# Altium project AUX_v7_4.PrjPcb
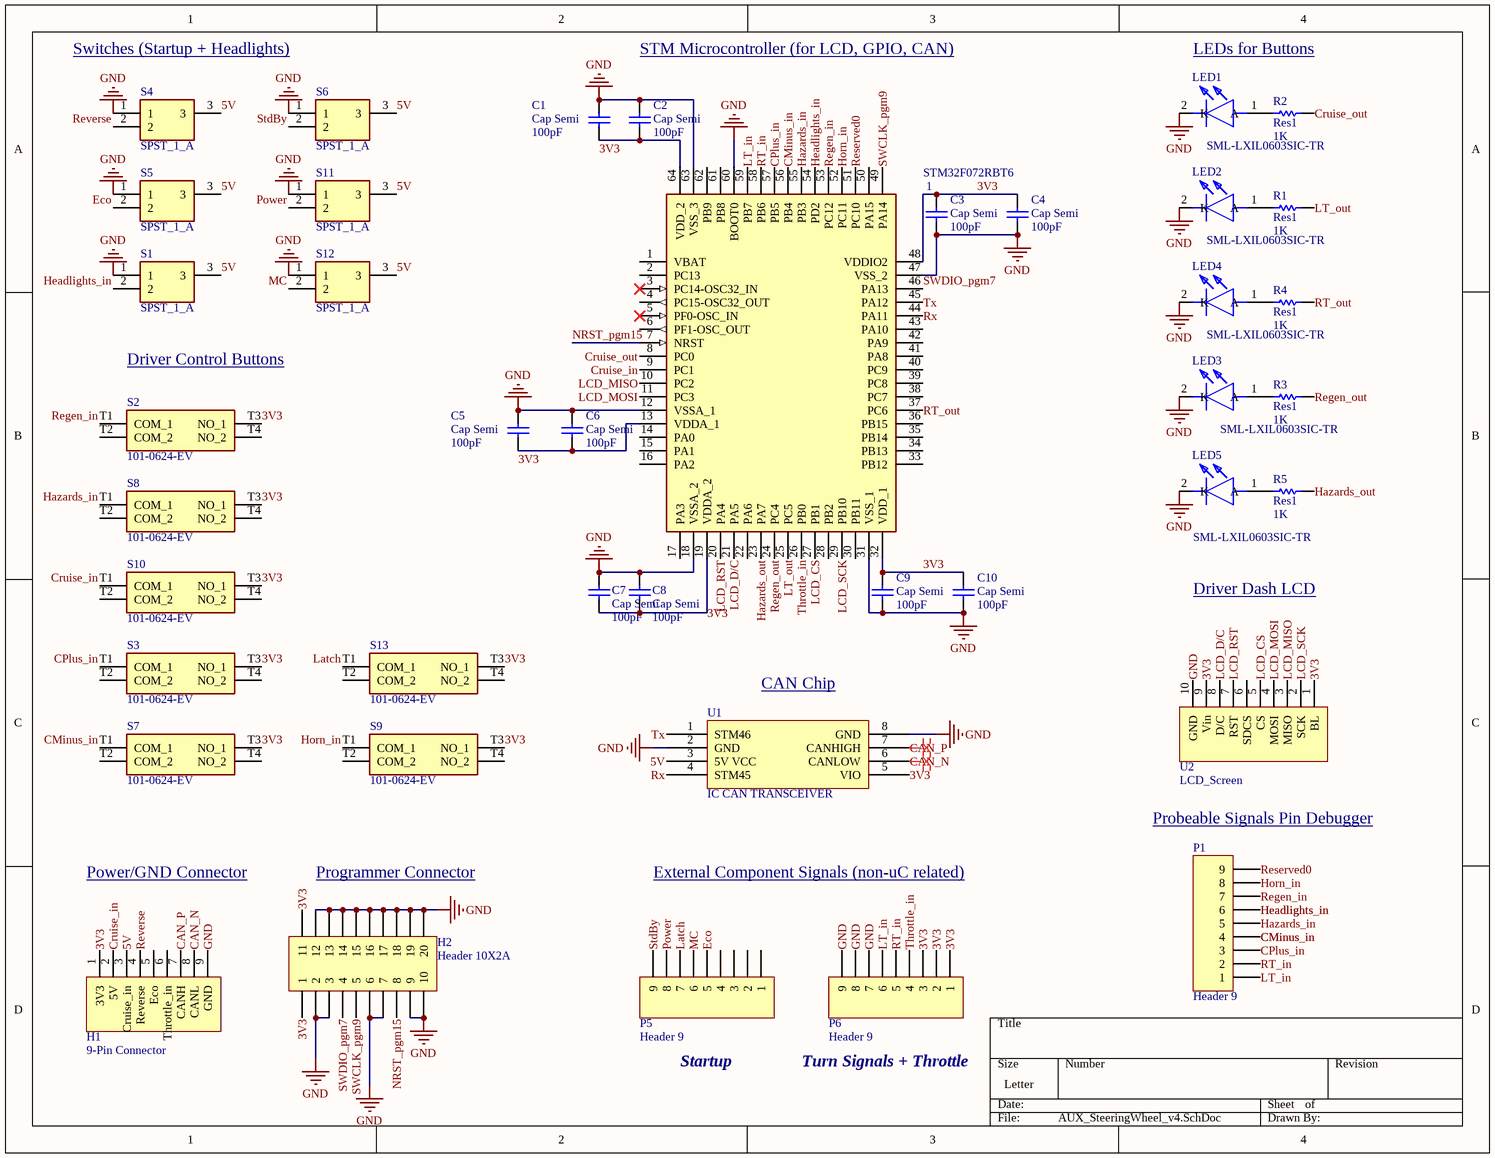
[diagram p0: AUX_SteeringWheel_v4.SchDoc]
1 sheet, 41 parts. Net scope: global (net labels, ports and power ports of the same name join across sheets).
Board file: AUX_SteeringWheel_v4.PcbDoc

## Sheet AUX_SteeringWheel_v4.SchDoc
size Letter

### Parts
1  STM32F072RBT6  [QFP50P1200X1200X160-64N]
C1  Cap Semi  value 100pF  [C1206]
C2  Cap Semi  value 100pF  [C1206]
C3  Cap Semi  value 100pF  [C1206]
C4  Cap Semi  value 100pF  [C1206]
C5  Cap Semi  value 100pF  [C1206]
C6  Cap Semi  value 100pF  [C1206]
C7  Cap Semi  value 100pF  [C1206]
C8  Cap Semi  value 100pF  [C1206]
C9  Cap Semi  value 100pF  [C1206]
C10  Cap Semi  value 100pF  [C1206]
H1  9-Pin Connector  [Rt_Angle_9-Pin]
H2  Header 10X2A  [HDR2X10_CEN]
LED1  SML-LXIL0603SIC-TR  [LED thru hole]
LED2  SML-LXIL0603SIC-TR  [LED thru hole]
LED3  SML-LXIL0603SIC-TR  [LED thru hole]
LED4  SML-LXIL0603SIC-TR  [LED thru hole]
LED5  SML-LXIL0603SIC-TR  [LED thru hole]
P1  Header 9  [HDR1X9]
P5  Header 9  [Rt_Angle_9-Pin]
P6  Header 9  [Rt_Angle_9-Pin]
R1  Res1  value 1K  [AXIAL-0.3]
R2  Res1  value 1K  [AXIAL-0.3]
R3  Res1  value 1K  [AXIAL-0.3]
R4  Res1  value 1K  [AXIAL-0.3]
R5  Res1  value 1K  [AXIAL-0.3]
S1  SPST_1_A  [2M1SP3T1B1M2QE]
S2  101-0624-EV  [1010624EV]
S3  101-0624-EV  [1010624EV]
S4  SPST_1_A  [2M1SP3T1B1M2QE]
S5  SPST_1_A  [2M1SP3T1B1M2QE]
S6  SPST_1_A  [2M1SP3T1B1M2QE]
S7  101-0624-EV  [1010624EV]
S8  101-0624-EV  [1010624EV]
S9  101-0624-EV  [1010624EV]
S10  101-0624-EV  [1010624EV]
S11  SPST_1_A  [2M1SP3T1B1M2QE]
S12  SPST_1_A  [2M1SP3T1B1M2QE]
S13  101-0624-EV  [1010624EV]
U1  IC CAN TRANSCEIVER  [CAN TRANSCEIVER]
U2  LCD_Screen  [LCD_Screen]

### Nets
GND: 1.12(VSSA_1) 1.18(VSSA_2) 1.31(VSS_1) 1.47(VSS_2) 1.60(BOOT0) 1.63(VSS_3) C1.2 C2.2 C3.1 C4.1 C5.2 C6.2 C7.2 C8.2 C9.1 C10.1 H1.9(GND) H2.2 H2.3 H2.6 H2.7 H2.9 H2.10 H2.12 H2.13 H2.14 H2.15 H2.16 H2.17 H2.18 H2.19 H2.20 LED1.2(K) LED2.2(K) LED3.2(K) LED4.2(K) LED5.2(K) P6.7 P6.8 P6.9 S1.1 S4.1 S5.1 S6.1 S11.1 S12.1 U1.2(GND) U1.8(GND) U2.10(GND)
3V3: 1.13(VDDA_1) 1.19(VDDA_2) 1.32(VDD_1) 1.48(VDDIO2) 1.64(VDD_2) C1.1 C2.1 C3.2 C4.2 C5.1 C6.1 C7.1 C8.1 C9.2 C10.2 H1.1(3V3) H2.1 H2.11 P6.1 P6.2 P6.3 S2.T3(NO_1) S3.T3(NO_1) S7.T3(NO_1) S8.T3(NO_1) S9.T3(NO_1) S10.T3(NO_1) S13.T3(NO_1) U1.5(VIO) U2.1(BL) U2.9(Vin)
5V: H1.3(Cruise_in) S1.3 S4.3 S5.3 S6.3 S11.3 S12.3 U1.3(5V_VCC)
CAN_N: H1.8(CANL) U1.6(CANLOW)
CAN_P: H1.7(CANH) U1.7(CANHIGH)
CMinus_in: 1.56(PB4) P1.4 S7.T1(COM_1)
CPlus_in: 1.57(PB5) P1.3 S3.T1(COM_1)
Cruise_in: 1.9(PC1) H1.2(5V) S10.T1(COM_1)
Cruise_out: 1.8(PC0) R2.1
Eco: P5.5 S5.2
Hazards_in: 1.55(PB3) P1.5 S8.T1(COM_1)
Hazards_out: 1.23(PA7) R5.1
Headlights_in: 1.54(PD2) P1.6 S1.2
Horn_in: 1.52(PC11) P1.8 S9.T1(COM_1)
Latch: P5.7 S13.T1(COM_1)
LCD_CS: 1.27(PB1) U2.5(CS)
LCD_D/C: 1.21(PA5) U2.8(D/C)
LCD_MISO: 1.10(PC2) U2.3(MISO)
LCD_MOSI: 1.11(PC3) U2.4(MOSI)
LCD_RST: 1.20(PA4) U2.7(RST)
LCD_SCK: 1.29(PB10) U2.2(SCK)
LT_in: 1.59(PB7) P1.1 P6.6
LT_out: 1.25(PC5) R1.1
MC: P5.6 S12.2
NRST_pgm15: 1.7(NRST) H2.8
Power: P5.8 S11.2
Regen_in: 1.53(PC12) P1.7 S2.T1(COM_1)
Regen_out: 1.24(PC4) R3.1
Reserved0: 1.51(PC10) P1.9
Reverse: H1.4(Reverse) S4.2
RT_in: 1.58(PB6) P1.2 P6.5
RT_out: 1.37(PC6) R4.1
Rx: 1.44(PA11) U1.4(STM45)
StdBy: P5.9 S6.2
SWCLK_pgm9: 1.49(PA14) H2.5
SWDIO_pgm7: 1.46(PA13) H2.4
Throttle_in: 1.26(PB0) P6.4
Tx: 1.45(PA12) U1.1(STM46)
NetLED1_1: LED1.1(A) R2.2
NetLED2_1: LED2.1(A) R1.2
NetLED3_1: LED3.1(A) R3.2
NetLED4_1: LED4.1(A) R4.2
NetLED5_1: LED5.1(A) R5.2

Not connected (* = marked no-connect by the designer): 1 1(VBAT) 2(PC13) 3(PC14-OSC32_IN)* 4(PC15-OSC32_OUT) 5(PF0-OSC_IN)* 6(PF1-OSC_OUT) 14(PA0) 15(PA1) 16(PA2) 17(PA3) 22(PA6) 28(PB2) 30(PB11) 33(PB12) 34(PB13) 35(PB14) 36(PB15) 38(PC7) 39(PC8) 40(PC9) 41(PA8) 42(PA9) 43(PA10) 50(PA15) 61(PB8) 62(PB9); H1 5(Eco) 6(Throttle_in); P5 1 2 3 4; S2 T2(COM_2) T4(NO_2); S3 T2(COM_2) T4(NO_2); S7 T2(COM_2) T4(NO_2); S8 T2(COM_2) T4(NO_2); S9 T2(COM_2) T4(NO_2); S10 T2(COM_2) T4(NO_2); S13 T2(COM_2) T4(NO_2); U2 6(SDCS)

### Layout directives
differential pair: CAN_N, CAN_P

### Notes on the sheet
- Switches (Startup + Headlights)
- STM Microcontroller (for LCD, GPIO, CAN)
- LEDs for Buttons
- Driver Control Buttons
- Driver Dash LCD
- (near U1) CAN Chip
- (near P1) Probeable Signals Pin Debugger
- Power/GND Connector
- Programmer Connector
- External Component Signals (non-uC related)
- Startup
- Turn Signals + Throttle

### Library data of the parts
1 = STM32F072RBT6: Integrated Circuit; Manufacturer_Name: STMicroelectronics; Datasheet Link: https://componentsearchengine.com/Datasheets/1/STM32F072RBT6.pdf; Height: 1.6mm; Mouser Part Number: 511-STM32F072RBT6; Mouser Price/Stock: https://www.mouser.com/Search/Refine.aspx?Keyword=511-STM32F072RBT6; Manufacturer_Part_Number: STM32F072RBT6
C1-C10 = Cap Semi: Capacitor (Semiconductor SIM Model); Published: 8-Jun-2000; LatestRevisionDate: 29-May-2009; LatestRevisionNote: IPC-7351 Footprint Added.; PackageReference: C1206; Publisher: Altium Limited; PackageDescription: Chip Capacitor
H2 = Header 10X2A: Header, 10-Pin, Dual row; LatestRevisionDate: 17-Jul-2002; LatestRevisionNote: Re-released for DXP Platform.; Publisher: Altium Limited
LED1 LED2 LED4 = SML-LXIL0603SIC-TR: Cruise; Manufacturer_Name: Lumex; Datasheet Link: https://componentsearchengine.com/Datasheets/1/SML-LXIL0603SIC-TR.pdf; Height: 1.15mm; Mouser2 Part Number: 696-SMLLXIL0603SICTR; Mouser2 Price/Stock: https://www.mouser.com/Search/Refine.aspx?Keyword=696-SMLLXIL0603SICTR; Manufacturer_Part_Number: SML-LXIL0603SIC-TR; ComponentLink1Description: Red; ComponentLink1URL: https://www.mouser.com/ProductDetail/Lumex/SML-LXIL0603SIC-TR?qs=sGAEpiMZZMseGfSY3csMkdgyOOAg6kv2wBhnt1KKZ0Ir1Jo46E1V3Q%3D%3D; ComponentLink2Description: Green; ComponentLink2URL: https://www.mouser.com/ProductDetail/Lumex/SML-LXIL0603UPGCTR?qs=sGAEpiMZZMseGfSY3csMkdgyOOAg6kv2sRjHcnaWQfp%2F9Np9qK5zmw%3D%3D; ComponentLink3Description: Blue; ComponentLink3URL: https://www.mouser.com/ProductDetail/Lumex/SML-LXIL0603USBCTR?qs=sGAEpiMZZMseGfSY3csMkdgyOOAg6kv2YTCj%2FpdrnHQXx1e9lymIRQ%3D%3D
LED3 = SML-LXIL0603SIC-TR: Headlights; Manufacturer_Name: Lumex; Datasheet Link: https://componentsearchengine.com/Datasheets/1/SML-LXIL0603SIC-TR.pdf; Height: 1.15mm; Mouser2 Part Number: 696-SMLLXIL0603SICTR; Mouser2 Price/Stock: https://www.mouser.com/Search/Refine.aspx?Keyword=696-SMLLXIL0603SICTR; Manufacturer_Part_Number: SML-LXIL0603SIC-TR; ComponentLink1Description: Red; ComponentLink1URL: https://www.mouser.com/ProductDetail/Lumex/SML-LXIL0603SIC-TR?qs=sGAEpiMZZMseGfSY3csMkdgyOOAg6kv2wBhnt1KKZ0Ir1Jo46E1V3Q%3D%3D; ComponentLink2Description: Green; ComponentLink2URL: https://www.mouser.com/ProductDetail/Lumex/SML-LXIL0603UPGCTR?qs=sGAEpiMZZMseGfSY3csMkdgyOOAg6kv2sRjHcnaWQfp%2F9Np9qK5zmw%3D%3D; ComponentLink3Description: Blue; ComponentLink3URL: https://www.mouser.com/ProductDetail/Lumex/SML-LXIL0603USBCTR?qs=sGAEpiMZZMseGfSY3csMkdgyOOAg6kv2YTCj%2FpdrnHQXx1e9lymIRQ%3D%3D
LED5 = SML-LXIL0603SIC-TR: Hazards; Manufacturer_Name: Lumex; Datasheet Link: https://componentsearchengine.com/Datasheets/1/SML-LXIL0603SIC-TR.pdf; Height: 1.15mm; Mouser2 Part Number: 696-SMLLXIL0603SICTR; Mouser2 Price/Stock: https://www.mouser.com/Search/Refine.aspx?Keyword=696-SMLLXIL0603SICTR; Manufacturer_Part_Number: SML-LXIL0603SIC-TR; ComponentLink1Description: Red; ComponentLink1URL: https://www.mouser.com/ProductDetail/Lumex/SML-LXIL0603SIC-TR?qs=sGAEpiMZZMseGfSY3csMkdgyOOAg6kv2wBhnt1KKZ0Ir1Jo46E1V3Q%3D%3D; ComponentLink2Description: Green; ComponentLink2URL: https://www.mouser.com/ProductDetail/Lumex/SML-LXIL0603UPGCTR?qs=sGAEpiMZZMseGfSY3csMkdgyOOAg6kv2sRjHcnaWQfp%2F9Np9qK5zmw%3D%3D; ComponentLink3Description: Blue; ComponentLink3URL: https://www.mouser.com/ProductDetail/Lumex/SML-LXIL0603USBCTR?qs=sGAEpiMZZMseGfSY3csMkdgyOOAg6kv2YTCj%2FpdrnHQXx1e9lymIRQ%3D%3D
P1 P5 P6 = Header 9: Header, 9-Pin; LatestRevisionDate: 17-Jul-2002; LatestRevisionNote: Re-released for DXP Platform.; Publisher: Altium Limited
R1-R5 = Res1: Resistor; Published: 8-Jun-2000; LatestRevisionDate: 17-Jul-2002; LatestRevisionNote: Re-released for DXP Platform.; PackageReference: AXIAL-0.3; Publisher: Altium Limited; PackageDescription: Axial Device, Thru-Hole; 2 Leads; 0.3 in Pin Spacing
S1 S4-S6 S11 S12 = 2M1-SP1-T1-B1-M2QE: Switch; Manufacturer_Name: Carling Technologies; Datasheet Link: https://componentsearchengine.com/Datasheets/1/2M1-SP1-T1-B1-M2QE.pdf; Height: 28.2mm; Mouser Part Number: 691-2M1-SP1-T1B1M2QE; Mouser Price/Stock: https://www.mouser.com/Search/Refine.aspx?Keyword=691-2M1-SP1-T1B1M2QE; Manufacturer_Part_Number: 2M1-SP1-T1-B1-M2QE
S2 S3 S7-S10 S13 = 101-0624-EV: Switch; Manufacturer_Name: Mountain Switch; Datasheet Link: https://componentsearchengine.com/Datasheets/1/101-0624-EV.pdf; Height: 7.3mm; Mouser Part Number: 101-0624-EV; Mouser Price/Stock: https://www.mouser.com/Search/Refine.aspx?Keyword=101-0624-EV; Manufacturer_Part_Number: 101-0624-EV
U1 = CAN TRANSCEIVER
U2 = LCD_Screen: LCD Display Screen